# EasyEDA schematic SESBOARD.json
TITLE: SESBOARD V1-2021; REV: 1.0; Date: 2021-04-17; Sheet: 1/1; Company: JKUATSES
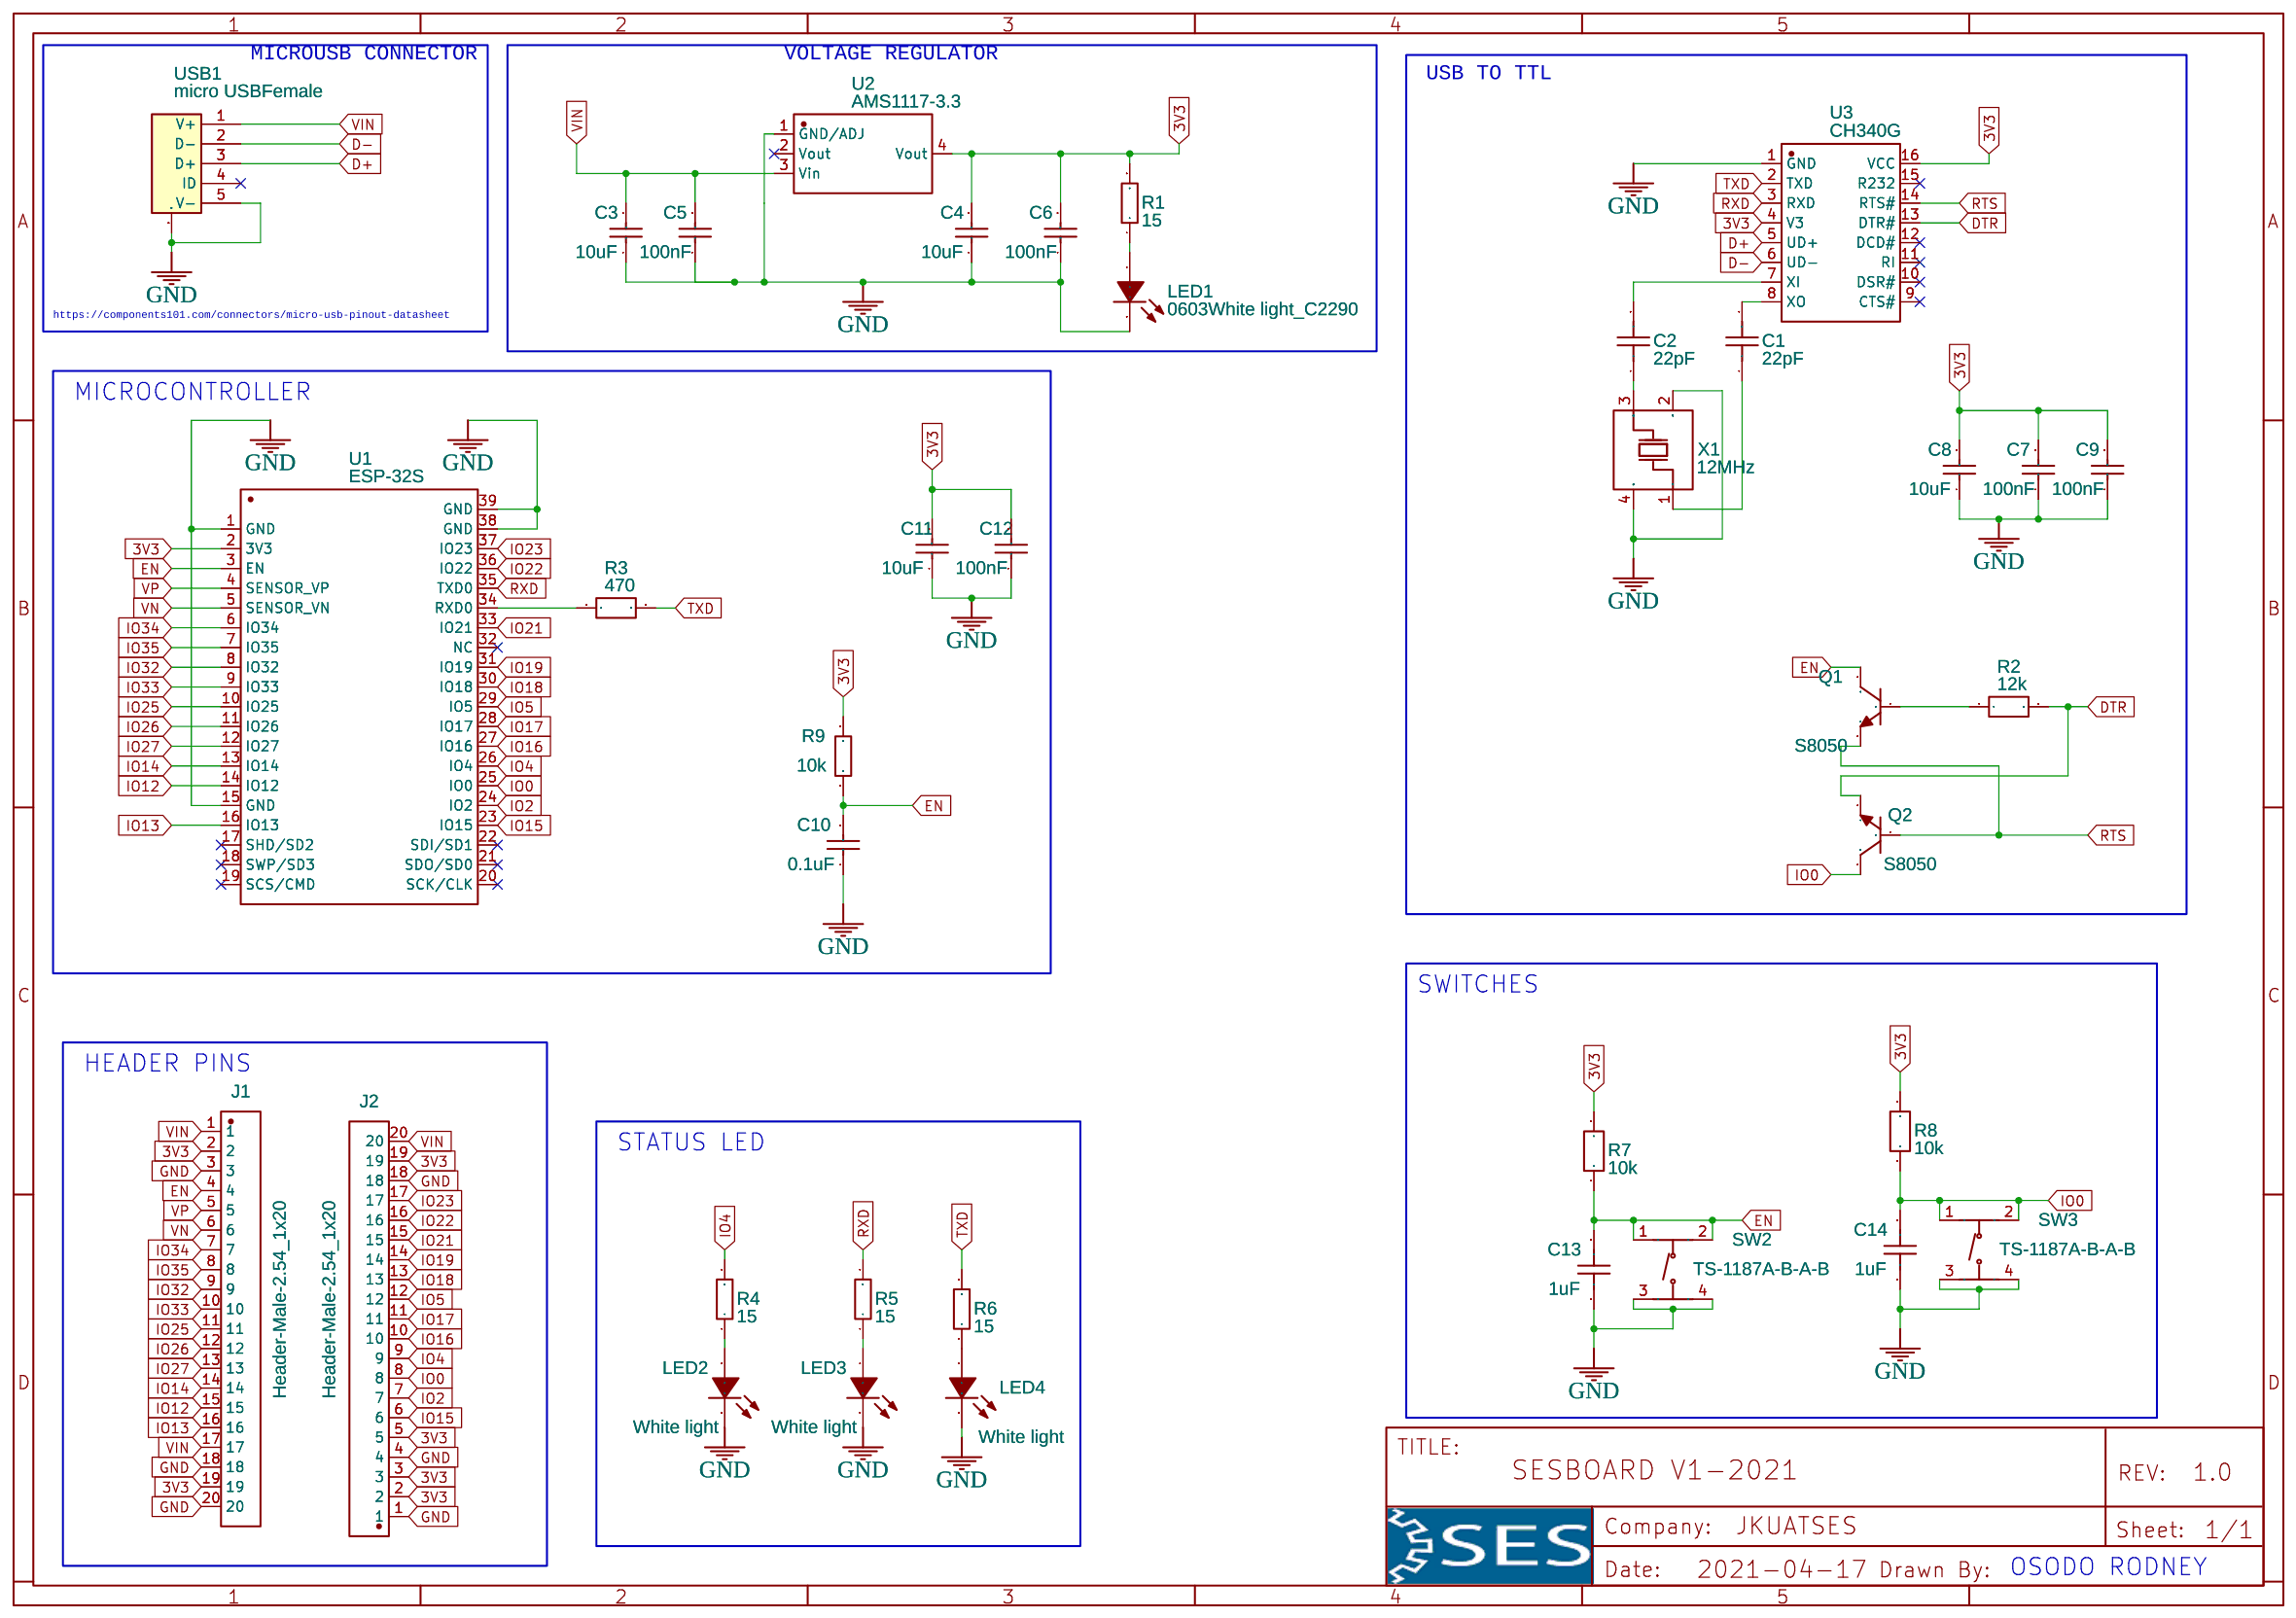
[diagram p0: schematic sheet]

## Parts
C1  22pF  [C0805]
C2  22pF  [C0805]
C3  10uF  [C0805]
C4  10uF  [C0805]
C5  100nF  [C0805]
C6  100nF  [C0805]
C7  100nF  [C0805]
C8  10uF  [C0805]
C9  100nF  [C0805]
C10  0.1uF  [C0805]
C11  10uF  [C0805]
C12  100nF  [C0805]
C13  1uF  [C0603]
C14  1uF  [C0603]
J1  Header-Male-2.54_1x20  [HDR-TH_20P-P2.54-V]
J2  Header-Male-2.54_1x20  [HDR-TH_20P-P2.54-V]
LED1  0603White light_C2290  [LED0603-R-RD]
LED2  White light  [LED0603-R-RD]
LED3  White light  [LED0603-R-RD]
LED4  White light  [LED0603-R-RD]
Q1  S8050  [SOT-23-3_L2.9-W1.3-P1.90-LS2.4-BR]
Q2  S8050  [SOT-23-3_L2.9-W1.3-P1.90-LS2.4-BR]
R1  15  [R0603]
R2  12k  [R0603]
R3  470  [R0603]
R4  15  [R0603]
R5  15  [R0603]
R6  15  [R0603]
R7  10k  [R0603]
R8  10k  [R0603]
R9  10k  [R0603]
SW2  TS-1187A-B-A-B  [SW-SMD_4P-L5.1-W5.1-P3.70-LS6.5-2]
SW3  TS-1187A-B-A-B  [SW-SMD_4P-L5.1-W5.1-P3.70-LS6.5-2]
U1  ESP-32S  [WIFIM-SMD_ESP-32S]
U2  AMS1117-3.3  [SOT-223-3_L6.5-W3.4-P2.30-LS7.0-BR]
U3  CH340G  [SOIC-16_L9.9-W3.9-P1.27-LS6.0-TL]
USB1  micro USBFemale  [MICRO-USB-SMD_5P-P0.65-H-F_C10418]
X1  12MHz  [OSC-SMD_4P-L3.2-W2.5-BL]

## Library data of the parts
C1 C2 = TCC0805COG220J500BT: Supplier: LCSC; Supplier Part: C376875; Manufacturer: CCTC; Contributor: LCSC
C3 C4 C8 C11 = CL21A106KPFNNNE: Supplier: LCSC; Manufacturer: SAMSUNG; Supplier Part: C17024; Paste Type: expand
C5-C7 C9 C10 C12 = CL21F104ZBCNNNC: Supplier: LCSC; Manufacturer: SAMSUNG; Supplier Part: C1760; Paste Type: expand
C13 C14 = C_0603_US: Contributor: LCEDA_Lib
J1 J2 = Header-Male-2.54_1x20: Supplier: LCSC; Manufacturer: BOOMELE; Manufacturer Part: 2.54mm 1*20PHeader; image: //image.lceda.cn/szlcsc/C50981.jpg; Supplier Part: C50981; LCSC Assembly: Yes; SMT Type: Extend; Paste Type: expand
LED1-LED4 = 0603White light_C2290: Supplier: LCSC; Manufacturer: KENTO; Manufacturer Part: 0603White light; image: //image.lceda.cn/szlcsc/C2290.jpg; Supplier Part: C2290; SMT Type: Basic; JLCPCB SMD: Yes; LCSC Assembly: Yes; Paste Type: base
Q1 Q2 = S8050: Supplier: LCSC; Supplier Part: C909746; Manufacturer: GOODWORK(固得沃克); Contributor: LCSC
R1 R4-R6 R9 = 0603WAF150JT5E: Supplier: LCSC; Manufacturer: UniOhm; Supplier Part: C22810; SMT Type: Basic; JLCPCB SMD: Yes; LCSC Assembly: Yes; Paste Type: base
R2 R3 R7 R8 = R_0603_EU: Contributor: LCEDA_Lib
SW2 SW3 = TS-1187A-B-A-B: Supplier: LCSC; Supplier Part: C318884; Manufacturer: XKB Enterprise; Contributor: LCSC; Paste Type: recommend
U1 = ESP-32S: Supplier: LCSC; Supplier Part: C82899; Manufacturer: Ai-Thinker; Contributor: LCSC; LCSC Assembly: Yes; SMT Type: Extend; Paste Type: expand
U2 = AMS1117-3.3: sourceId: dwIGgezVh; Supplier: LCSC; Manufacturer: AMS; image: //image.lceda.cn/szlcsc/C6186.jpg; Supplier Part: C6186; SMT Type: Basic; JLCPCB SMD: Yes; LCSC Assembly: Yes; Paste Type: base
U3 = CH340G: Supplier: LCSC; Manufacturer: WCH; image: //image.lceda.cn/szlcsc/C14267.jpg; Supplier Part: C14267; SMT Type: Basic; JLCPCB SMD: Yes; Paste Type: base
USB1 = micro USBFemale: Supplier: LCSC; Manufacturer: ValuePro; image: //image.lceda.cn/szlcsc/C10418.jpg; Supplier Part: C10418
X1 = X322512MSB4SI: Supplier: LCSC; Manufacturer: YXC; Supplier Part: C9002; SMT Type: Basic; JLCPCB SMD: Yes; LCSC Assembly: Yes; Paste Type: base

## Nets
3V3: C4.2 C6.2 C7.2 C8.2 C9.2 C11.2 C12.2 J1.2 J1.19 J2.2 J2.3 J2.5 J2.19 R1.2 R7.2 R8.2 R9.2 U1.2(3V3) U2.4(Vout) U3.4(V3) U3.16(VCC)
GND: C3.1 C4.1 C5.1 C6.1 C7.1 C8.1 C9.1 C10.1 C11.1 C12.1 C13.1 C14.1 J1.3 J1.18 J1.20 J2.1 J2.4 J2.18 LED1.2(K) LED2.2(K) LED3.2(K) LED4.2(K) SW2.3(C) SW2.4(D) SW3.3(C) SW3.4(D) U1.1(GND) U1.15(GND) U1.38(GND) U1.39(GND) U2.1(GND/ADJ) U3.1(GND) USB1.0(MTN) USB1.5(V-) X1.2(GND) X1.4(GND)
VIN: C3.2 C5.2 J1.1 J1.17 J2.20 U2.3(Vin) USB1.1(V+)
D+: U3.5(UD+) USB1.3(D+)
D-: U3.6(UD-) USB1.2(D-)
DTR: Q2.2(E) R2.2 U3.13(DTR#)
EN: C10.2 C13.2 J1.4 Q1.3(C) R7.1 R9.1 SW2.1(A) SW2.2(B) U1.3(EN)
IO0: C14.2 J2.8 Q2.3(C) R8.1 SW3.1(A) SW3.2(B) U1.25(IO0)
IO2: J2.7 U1.24(IO2)
IO4: J2.9 R4.2 U1.26(IO4)
IO5: J2.12 U1.29(IO5)
IO12: J1.15 U1.14(IO12)
IO13: J1.16 U1.16(IO13)
IO14: J1.14 U1.13(IO14)
IO15: J2.6 U1.23(IO15)
IO16: J2.10 U1.27(IO16)
IO17: J2.11 U1.28(IO17)
IO18: J2.13 U1.30(IO18)
IO19: J2.14 U1.31(IO19)
IO21: J2.15 U1.33(IO21)
IO22: J2.16 U1.36(IO22)
IO23: J2.17 U1.37(IO23)
IO25: J1.11 U1.10(IO25)
IO26: J1.12 U1.11(IO26)
IO27: J1.13 U1.12(IO27)
IO32: J1.9 U1.8(IO32)
IO33: J1.10 U1.9(IO33)
IO34: J1.7 U1.6(IO34)
IO35: J1.8 U1.7(IO35)
RTS: Q1.2(E) Q2.1(B) U3.14(RTS#)
RXD: R5.2 U1.35(TXD0) U3.3(RXD)
TXD: R3.2 R6.2 U3.2(TXD)
VN: J1.6 U1.5(SENSOR_VN)
VP: J1.5 U1.4(SENSOR_VP)
Net-(C1-1): C1.1 X1.1(OSC1)
Net-(C1-2): C1.2 U3.8(XO)
Net-(C2-1): C2.1 X1.3(OSC2)
Net-(C2-2): C2.2 U3.7(XI)
Net-(LED1-1): LED1.1(A) R1.1
Net-(LED2-1): LED2.1(A) R4.1
Net-(LED3-1): LED3.1(A) R5.1
Net-(LED4-1): LED4.1(A) R6.1
Net-(Q1-1): Q1.1(B) R2.1
Net-(R3-1): R3.1 U1.34(RXD0)

Not connected (* = marked no-connect by the designer): U1 17(SHD/SD2)* 18(SWP/SD3)* 19(SCS/CMD)* 20(SCK/CLK)* 21(SDO/SD0)* 22(SDI/SD1)* 32(NC)*; U2 2(Vout)*; U3 9(CTS#)* 10(DSR#)* 11(RI)* 12(DCD#)* 15(R232)*; USB1 4(ID)*

## Notes on the sheet
- MICROUSB CONNECTOR
- VOLTAGE REGULATOR
- USB TO TTL
- https://components101.com/connectors/micro-usb-pinout-datasheet
- MICROCONTROLLER
- SWITCHES
- HEADER PINS
- STATUS LED
- OSODO RODNEY
